# EAGLE design fet-dd-charger-20mm-mk-1.0-bottom (EAGLE 7.5.0)
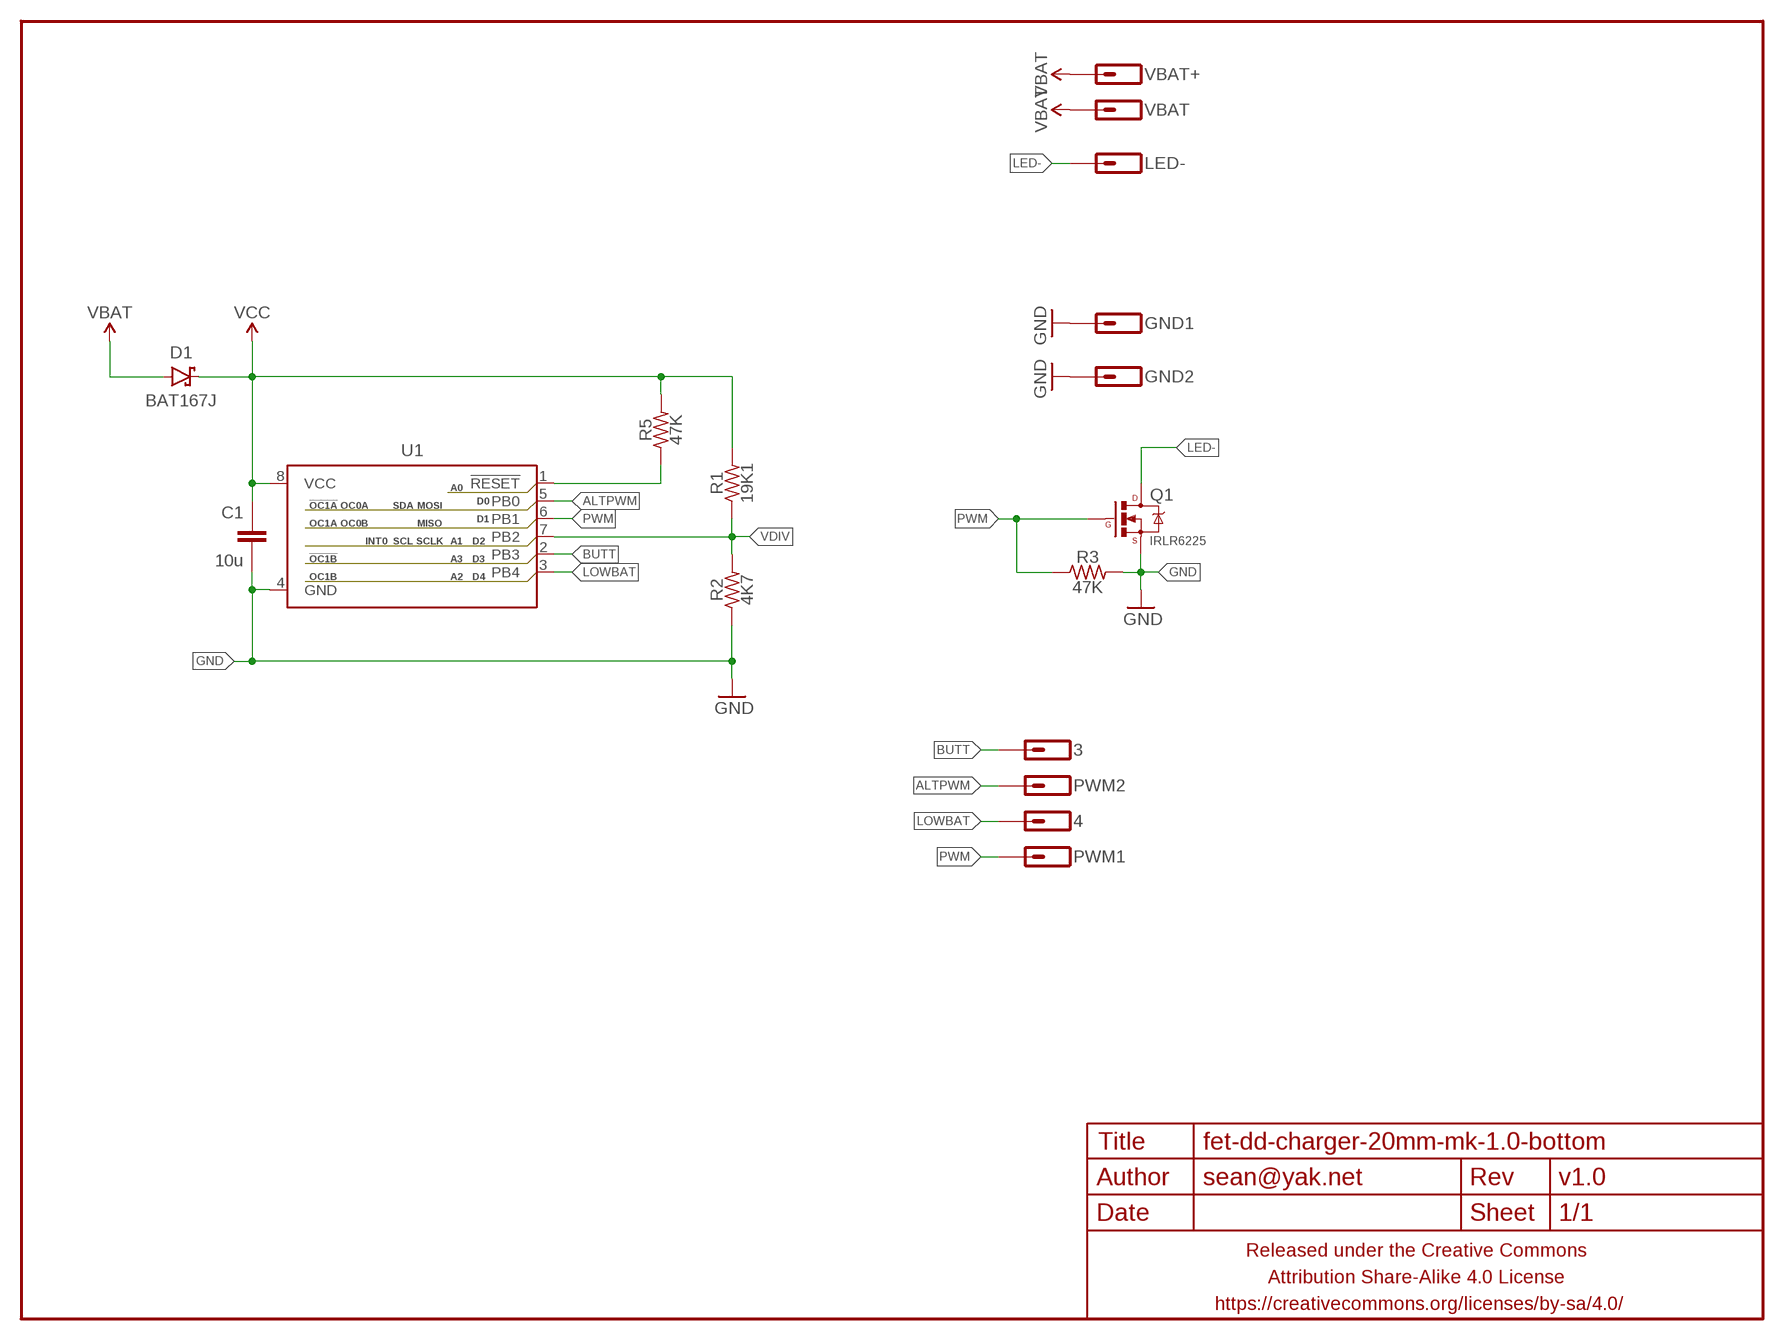
[diagram p0: schematic, sheet 1]

## Parts
3  M01SMD-1MM-DIA-NS  [1X01-SMD-1MM-DIA-NS]
4  M01SMD-1MM-DIA-NS  [1X01-SMD-1MM-DIA-NS]
C1  10u  CAPACITOR-CERAMICC0603-TIGHTER  [C0603-TIGHTER]
D1  BAT167J  DIODE-SCHOTTKYSOD123  [SOD123-SCHOTTKY]
FRAME1  FRAME-LETTERNO_PACKAGE  [DUMMY]
GND1  M01PTH_2MM  [1X01_2MM]
GND2  M01PTH_2MM  [1X01_2MM]
LED-  M01PTH_2MM  [1X01_2MM]
PWM1  M01SMD-1MM-DIA-NS  [1X01-SMD-1MM-DIA-NS]
PWM2  M01SMD-1MM-DIA-NS  [1X01-SMD-1MM-DIA-NS]
Q1  IRLR6225  MOSFET-NCHANNELSIR800DP  [POWERPACK-SO-8]
R1  19K1  RESISTORR0603-TIGHTER  [R0603-TIGHTER]
R2  4K7  RESISTORR0603-TIGHTER  [R0603-TIGHTER]
R3  47K  RESISTORR0603-TIGHTER  [R0603-TIGHTER]
R5  47K  RESISTORR0603-TIGHTER  [R0603-TIGHTER]
U1  ATTINY13SOIC-NARROWPADS  [SO08-NARROWER]
VBAT  M01PTH_2MM  [1X01_2MM]
VBAT+  M01NOSTOP-CANTSTOP-DONTKNOWHOWTOSTOP  [1X01_SMD_NOSTOP_NOSILK]

## Nets
ALTPWM: PWM2.P$1 U1.5(PB0)
BUTT: 3.P$1 U1.2(PB3)
GND: C1.2 GND1.1 GND2.1 Q1.1(S) Q1.2(S) Q1.3(S) R2.1 R3.2 U1.4(GND)
LED-: LED-.1 Q1.5678(D)
LOWBAT: 4.P$1 U1.3(PB4)
N$1: R5.1 U1.1(!RESET)
PWM: PWM1.P$1 Q1.4(G) R3.1 U1.6(PB1)
VBAT: D1.A VBAT+.1 VBAT.1
VCC: C1.1 D1.C R1.2 R5.2 U1.8(VCC)
VDIV: R1.1 R2.2 U1.7(PB2)

## Library data of the parts
3 4 GND1 GND2 LED- PWM1 PWM2 VBAT VBAT+ = a_parts:M01: Header 1 Standard 1-pin 0.1" header. Use with straight break away headers (SKU : PRT-00116), right angle break away headers (PRT-00553), swiss pins (PRT-00743), machine pins (PRT-00117), and female headers (PRT-00115).
C1 = a_parts:CAPACITOR-CERAMIC: CAPACITOR, European symbol
D1 = a_parts:DIODE-SCHOTTKY: Schottky diodes in SFE's production catalog BAT20J 1A 23V 0.62Vf RB751 120mA 40V 0.37Vf PMEG4005EJ 0.5A 40V 0.42Vf MBRA140 1A 40V 0.5Vf B340A 3A 40V SMA
FRAME1 = a_parts:FRAME-LETTER: Schematic Frame Standard 8.5x11 US Letter frame; DESIGNER: sean@yak.net; VERSION: v1.0
Q1 = a_parts:MOSFET-NCHANNEL: Common NMOSFET Parts MFG P/N Store ID Prod ID FDD8780 TRANS-09984 SI7820DN TRANS-11055 FDS6630A IC-08089 2N7002PW TRANS-11151 FQP30N06L COM-10213 TRANS-10060 BSS123LT1G TRANS-08345 BSS138 TRANS-00830 BS170 2N7000
R1-R3 R5 = a_parts:RESISTOR: RESISTOR, American symbol
U1 = a_parts:ATTINY13: Atmel 8-pin 1kB flash uC

## Board
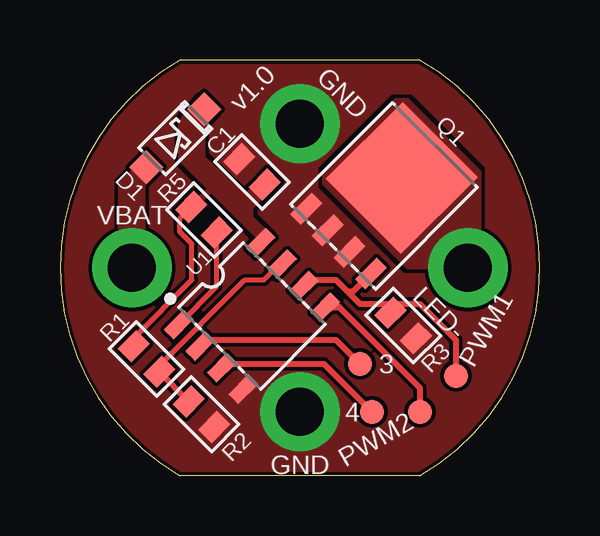
[diagram p1: board, top side]
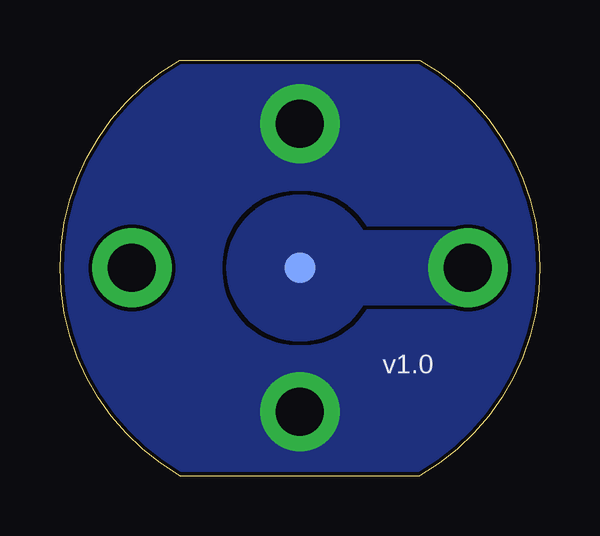
[diagram p2: board, bottom side, seen from below]

Size 20 x 17.32 mm. Coordinates in mm from the lower left corner, seen from the top.
Outline: 15,0 5,0 arc-120 5,17.32 15,17.32 arc-120 15,0
Copper layers (1*16): Top 0.0356mm / dielectric 1.5011mm / Bottom 0.0356mm
Design rules "LaenPCBOrder2": minimum track width 6mil, minimum drill 13mil, track to track 6mil, track to pad 6mil, pad to pad 6mil, via to via 6mil, smd to smd 6mil, copper to edge 6mil, drill to drill 6mil, minimum pad ring 7mil, minimum via ring 7mil, stop-mask expansion 3mil, vias tented up to drill 20mil, thermal gap 10mil

### Footprints (pad centres in the part's own frame; a part is rotated, then mirrored left to right if it is on the bottom)
1X01-SMD-1MM-DIA-NS = smd 1 x 1: P$1 0,0
C0603-TIGHTER = smd 0.8 x 1.1: 1 -0.75,0; 2 0.75,0
SOD123-SCHOTTKY = smd 1 x 1: A -1.7,0; C 1.7,0
1X01_2MM = drill 2 pad 3.302: 1 0,0
POWERPACK-SO-8 = smd 1.27 x 0.61: 1 -2.67,1.905; 2 -2.67,0.635; 3 -2.67,-0.635; 4 -2.67,-1.905 | smd 4.52 x 4.42: 5678 1.045,0
R0603-TIGHTER = smd 0.8 x 1.1: 1 -0.75,0; 2 0.75,0
SO08-NARROWER = smd 0.6 x 1.2: 1 -1.905,-2.416; 2 -0.635,-2.416; 3 0.635,-2.416; 4 1.905,-2.416; 5 1.905,2.416; 6 0.635,2.416; 7 -0.635,2.416; 8 -1.905,2.416
1X01_SMD_NOSTOP_NOSILK = smd 1.27 x 1.27: 1 0,0

### Placement (x,y rotation side)
3  12.5,4.66 90 top
4  13,2.66 0 top
C1  8,12.66 135 top
D1  4.8,14.06 45 top
FRAME1  0,-1.34 0 top
GND1  10,2.66 180 top
GND2  10,14.66 0 top
LED-  17,8.66 270 top
PWM1  16.5,4.16 0 top
PWM2  15,2.66 0 top
Q1  13.5,11.66 45 top
R1  3.6,4.86 135 top
R2  5.9,2.56 135 top
R3  14.3,6.26 315 top
R5  6,10.66 135 top
U1  8,6.66 315 top
VBAT  3,8.66 90 top
VBAT+  10,8.66 0 bottom

### Tracks (layer width: path | path; a pad name or v marks a point on that pad's centre or on a via)
ALTPWM
  Top 0.25: U1.5 11.64,7.02 15,3.66 PWM2.P$1
BUTT
  Top 0.25: U1.2 6.1,5.66 11.5,5.66 3.P$1
GND
  pour Top (isolate 0.152, rank 6, no thermals): 0,-1.34 20,-1.34 20,18.66 0,18.66
  pour Bottom (isolate 0.152, rank 6, no thermals): 0,-1.34 20,-1.34 20,18.66 0,18.66
LED-
  pour Top (isolate 0.152, rank 2, no thermals): 11,12.16 14.5,8.66 15.5,8.66 16.5,7.66 17.5,7.66 18,8.16 18,9.16 17.5,9.66 17.5,12.66 14.5,15.66 14,15.66 11,12.66
LOWBAT
  Top 0.25: U1.3 6.9,4.66 11,4.66 4.P$1
N$1
  Top 0.2: U1.1 6.53,7.88 R5.1
PWM
  Top 0.25: R3.1 13.77,6.93 14,7.16 | PWM1.P$1 16.5,5.66 15,7.16 14,7.16 | U1.6 10.4,8.16 11.5,8.16 12,7.66 | 12,7.66 12.5,7.16 14,7.16 | Q1.4 12.19,7.66 12,7.66
VBAT
  pour Bottom (isolate 0.152, rank 2, no thermals): 10,5.66 arc-90 7,8.66 arc-90 10,11.66 arc-90 13,8.66 arc-90
  pour Bottom (isolate 0.152, rank 2, no thermals): 1.5,8.16 1.5,9.16 2.5,10.16 10,10.16 10.5,9.66 10.5,7.66 10,7.16 2.5,7.16
  pour Top (isolate 0.152, rank 2, no thermals): 3.5,13.16 3.8,12.86 3.5,12.66 3.5,8.16 2.5,8.16 2.5,12.16
VCC
  Top 0.2: R1.2 3.07,5.73 5.5,8.16 5.5,9.66 5,10.16 5,10.72 R5.2
  pour Top (isolate 0.152, rank 2, no thermals): 5.9,15.76 5,14.76 5,13.16 6.2,11.96 5.1,10.96 5.2,10.86 6.3,11.86 8.5,9.66 8.8,9.96 8,10.76 8,11.16 9,12.16 8.6,12.56 7.7,11.66 6,13.26 6,14.66 6.5,15.16
VDIV
  Top 0.2: R1.1 4.13,4.59 7.7,8.16 8.5,8.16 9.16,8.82 U1.7
  Top 0.25: R2.2 R1.1

### Text on the board
tNames: GND | GND